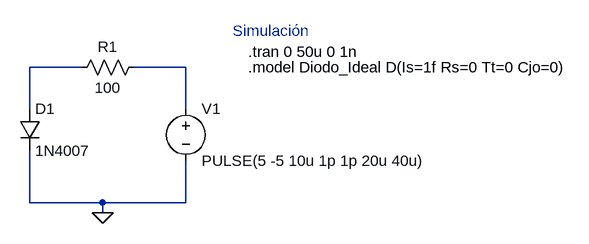
[diagram p0: schematic TPT1 - Rectificación Ideal vs Real.asc]
TPT1 - Rectificación Ideal vs Real.asc, the LTspice schematic file:
Version 4
SHEET 1 888 680
WIRE -64 16 -144 16
WIRE 96 16 16 16
WIRE -144 80 -144 16
WIRE 96 80 96 16
WIRE -144 224 -144 144
WIRE -32 224 -144 224
WIRE 96 224 96 160
WIRE 96 224 -32 224
WIRE -32 240 -32 224
FLAG -32 240 0
SYMBOL voltage 96 64 R0
WINDOW 123 0 0 Left 0
WINDOW 39 0 0 Left 0
SYMATTR InstName V1
SYMATTR Value PULSE(5 -5 10u 1p 1p 20u 40u)
SYMBOL res 32 0 R90
WINDOW 0 0 56 VBottom 2
WINDOW 3 32 56 VTop 2
SYMATTR InstName R1
SYMATTR Value 100
SYMBOL diode -160 80 R0
SYMATTR InstName D1
SYMATTR Value 1N4007
TEXT 168 -40 Left 2 ;Simulación
TEXT 192 -8 Left 2 !.tran 0 50u 0 1n
TEXT 192 16 Left 2 !.model Diodo_Ideal D(Is=1f Rs=0 Tt=0 Cjo=0)

The netlist it stands for:
* TPT1 - Rectificación Ideal vs Real.asc
V1 N002 0 PULSE(5 -5 10u 1p 1p 20u 40u)
R1 N002 N001 100
D1 N001 0 1N4007
.model D D
.lib standard.dio
* Simulación
.tran 0 50u 0 1n
.model Diodo_Ideal D(Is=1f Rs=0 Tt=0 Cjo=0)
.backanno
.end